# EAGLE design Shield_bmp280_Lora (EAGLE 9.6.1)
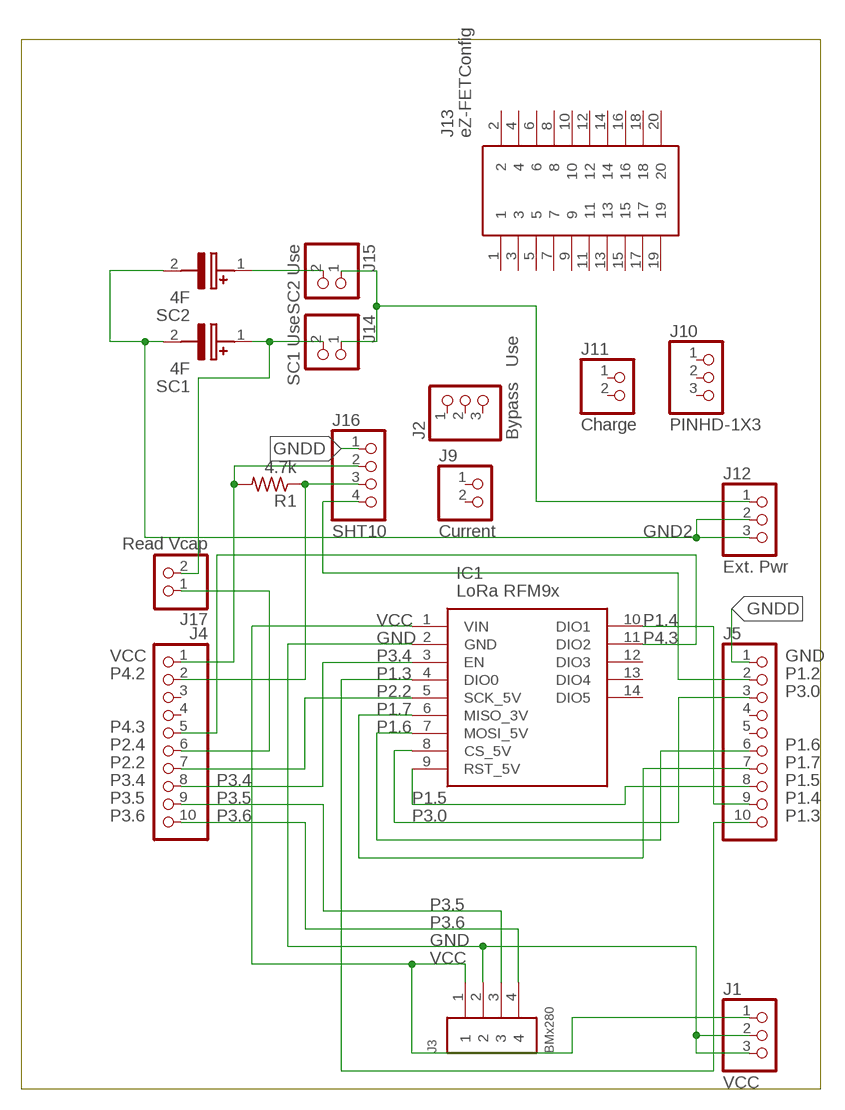
[diagram p0: schematic, sheet 1]

## Parts
IC1  LoRa RFM9x  3072  [3072]
J1  VCC  PINHD-1X3  [1X03]
J2  Bypass Use  PINHD-1X3  [1X03]
J3  BMx280  61300411121  [61300411121]
J4  VCC  PINHD-1X10  [1X10-BIG]
J5  GND  PINHD-1X10  [1X10-BIG]
J9  Current  PINHD-1X2  [1X02]
J10  PINHD-1X3  [1X03]
J11  Charge  PINHD-1X2  [1X02]
J12  Ext. Pwr  PINHD-1X3  [1X03]
J13  eZ-FETConfig  HWS1881  [HWS1881]
J14  SC1 Use  PINHD-1X2  [1X02]
J15  SC2 Use  PINHD-1X2  [1X02]
J16  SHT10  PINHD-1X4  [1X04]
J17  Read Vcap  PINHD-1X2  [1X02]
R1  4.7k  R-US_0204/7  [0204/7]
SC1  4F  EEC-RG0V105VN  [EECRG0V105VN]
SC2  4F  EEC-RG0V105VN  [EECRG0V105VN]

## Nets
GND: IC1.2(GND) J1.2 J1.3 J3.2
GND2: J12.2 J12.3 SC1.2(-) SC2.2(-)
GNDD: J5.1 J16.1
N$2: J14.2 J17.2 SC1.1(+)
N$3: J15.2 SC2.1(+)
P1.2: J5.2 J16.4
P1.3: IC1.4(DIO0) J5.10
P1.4: IC1.10(DIO1) J5.9
P1.5: IC1.9(RST_5V) J5.8
P1.6: IC1.7(MOSI_5V) J5.6
P1.7: IC1.6(MISO_3V) J5.7
P2.2: IC1.5(SCK_5V) J4.7
P2.4: J4.6 J17.1
P3.0: IC1.8(CS_5V) J5.3
P3.4: IC1.3(EN) J4.8
P3.5: J3.3 J4.9
P3.6: J3.4 J4.10
P4.2: J4.2 J16.3 R1.1
P4.3: IC1.11(DIO2) J4.5
VCC: IC1.1(VIN) J1.1 J3.1
VCCA: J4.1 J16.2 R1.2
VCCC: J12.1 J14.1 J15.1
Unconnected: IC1.12(DIO3) IC1.13(DIO4) IC1.14(DIO5) J2.1 J2.2 J2.3 J4.3 J4.4 J5.4 J5.5 J9.1 J9.2 J10.1 J10.2 J10.3 J11.1 J11.2 J13.1 J13.2 J13.3 J13.4 J13.5 J13.6 J13.7 J13.8 J13.9 J13.10 J13.11 J13.12 J13.13 J13.14 J13.15 J13.16 J13.17 J13.18 J13.19 J13.20

## Library data of the parts
IC1 = 3072:3072: RF Development Tools Adafruit RFM95W LoRa Radio Transceiver Breakout - 868 or 915 MHz - RadioFruit Source: Datasheet <https://cdn-learn.adafruit.com/downloads/pdf/adafruit-rfm69hcw-and-rfm96-rfm95-rfm98-lora-packet-padio-breakouts.pdf?timestamp=1543558897>; ALLIED_NUMBER: 70928126; ALLIED_PRICE-STOCK: https://www.alliedelec.com/adafruit-industries-3072/70928126/; DESCRIPTION: RF Development Tools Adafruit RFM95W LoRa Radio Transceiver Breakout - 868 or 915 MHz - RadioFruit; HEIGHT: 4mm; MANUFACTURER_NAME: Adafruit; MANUFACTURER_PART_NUMBER: 3072; MOUSER_PART_NUMBER: 485-3072; MOUSER_PRICE-STOCK: https://www.mouser.co.uk/ProductDetail/Adafruit/3072?qs=AGnqjqvSJvLNoNWdrCTgvw%3D%3D
J1 J2 J10 J12 = Connector:PINHD-1X3: PIN HEADER; CATEGORY: CONNECTOR; SUB-CATEGORY: PIN-HEADER
J3 = Headers:61300411121: CONN HEADER VERT 4POS 2.54MM Manufacturer's datasheet <https://katalog.we-online.de/em/datasheet/6130xx11121.pdf>; CREATED_BY: PCBLayout.com; DIGI_KEY_PART_NUMBER: 732-5317-ND; MANUFACTURER: Wurth Electronics Inc.; MPN: 61300411121
J4 J5 = adafruit:PINHD-1X10: Pin header 1x10 0.1" spacing With round pins
J9 J11 J14 J15 J17 = Connector:PINHD-1X2: PIN HEADER; CATEGORY: CONNECTOR; SUB-CATEGORY: PIN-HEADER
J13 = HWS1881:HWS1881: FEMALE HEADER SOCKET 20 PIN 2X10 FEMALE RECEPTACLE RIGHT ANGLE .1"(2.54mm) CENTERLINE (.1" Pin Spacing .1" Row Spacing) DUAL ROW MATES WITH .025" SQUARE POST HEADERS GOLD PLATED CONTACTS PCB MOUNT SOLDER TAILS Source: Datasheet <https://www.peconnectors.com/female-headers-pcb-2x-row-.100/hws16307/?gclid=EAIaIQobChMI66Wj_9bL5AIVAtlkCh3PUwyBEAQYAiABEgKUsvD_BwE>; DESCRIPTION: FEMALE HEADER SOCKET 20 PIN 2X10 FEMALE RECEPTACLE RIGHT ANGLE .1"(2.54mm) CENTERLINE (.1" Pin Spacing .1" Row Spacing) DUAL ROW MATES WITH .025" SQUARE POST HEADERS GOLD PLATED CONTACTS PCB MOUNT SOLDER TAILS; HEIGHT: 8.5mm; MANUFACTURER_NAME: PE Connectors; MANUFACTURER_PART_NUMBER: HWS1881
J16 = Connector:PINHD-1X4: PIN HEADER; CATEGORY: CONNECTOR; SUB-CATEGORY: PIN-HEADER
R1 = adafruit:R-US_: RESISTOR, American symbol
SC1 SC2 = EEC-RG0V105VN:EEC-RG0V105VN: Supercapacitors / Ultracapacitors FACTORY NOT ACCEPTING ORDERS Source: Datasheet <https://industrial.panasonic.com/cdbs/www-data/pdf/RDG0000/ABC0000C81.pdf>; DESCRIPTION: Supercapacitors / Ultracapacitors FACTORY NOT ACCEPTING ORDERS; HEIGHT: 21mm; MANUFACTURER_NAME: Panasonic; MANUFACTURER_PART_NUMBER: EEC-RG0V105VN; MOUSER_PART_NUMBER: 667-EEC-RG0V105VN; MOUSER_PRICE-STOCK: https://www.mouser.com/Search/Refine.aspx?Keyword=667-EEC-RG0V105VN

## Board
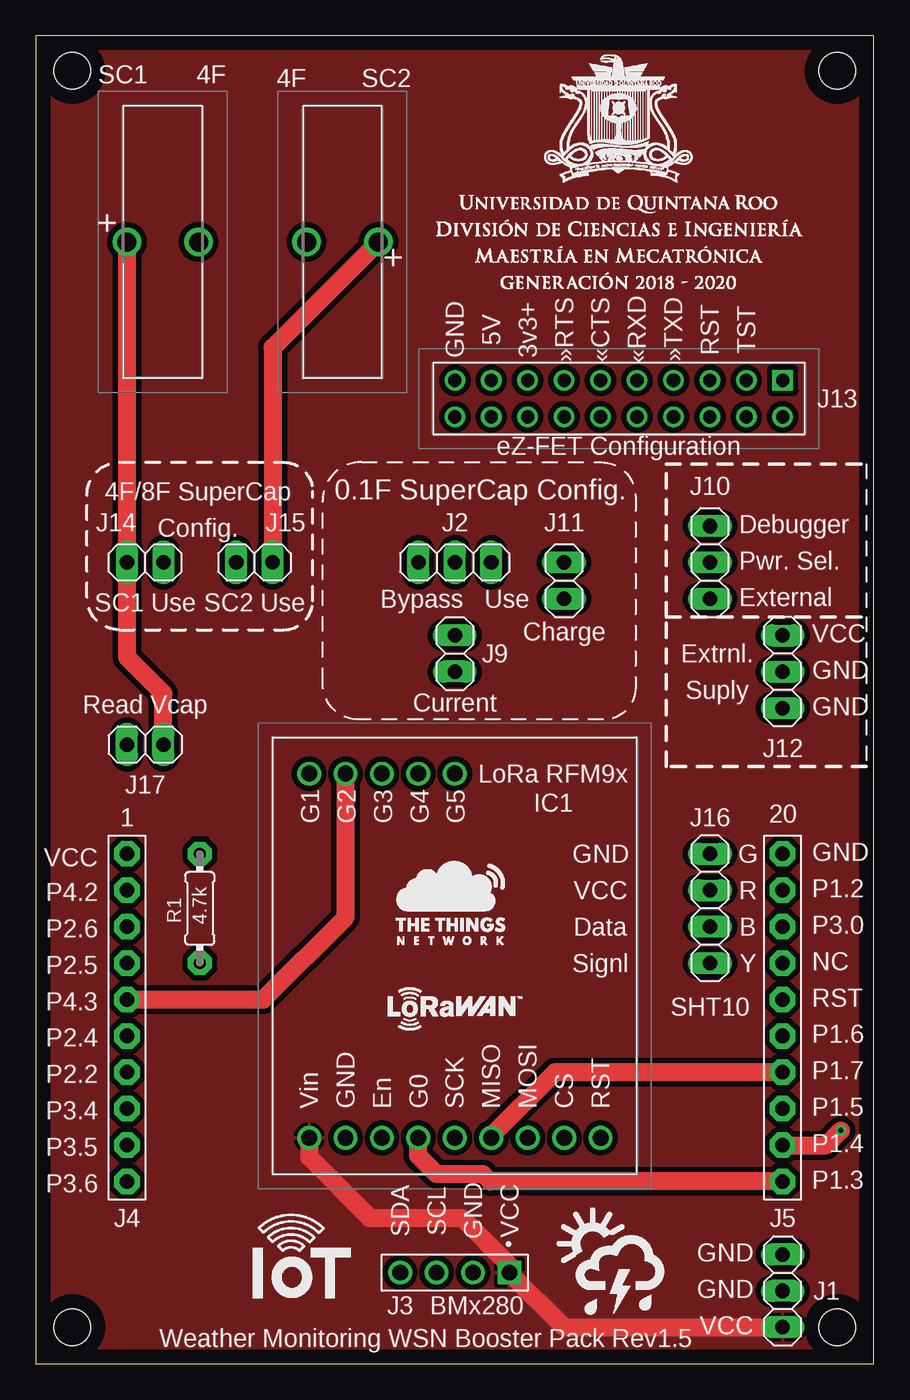
[diagram p1: board, top side]
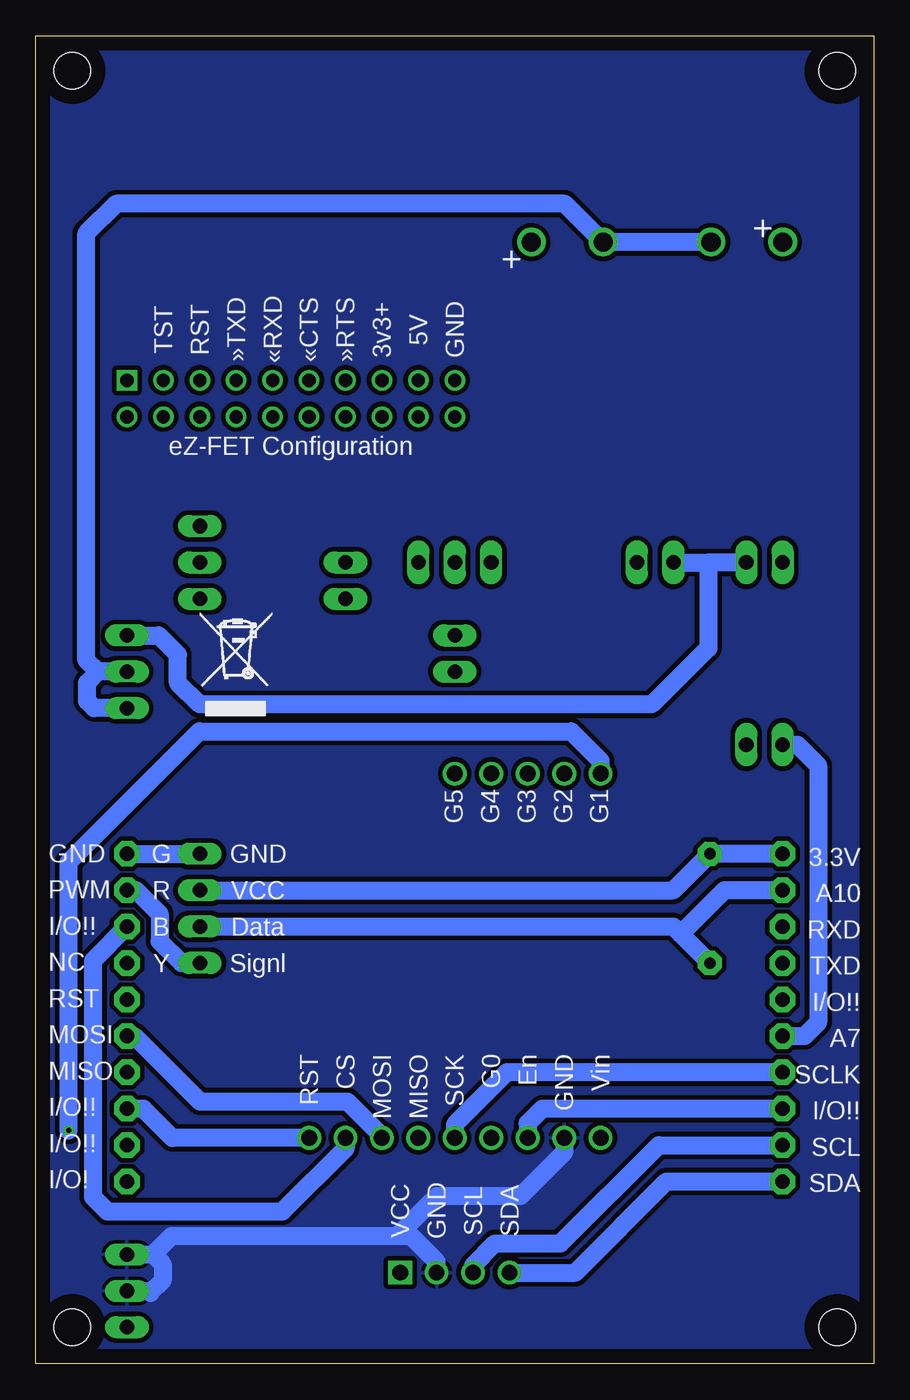
[diagram p2: board, bottom side, seen from below]

Size 58.42 x 92.61 mm. Coordinates in mm from the lower left corner, seen from the top.
Outline: 0,0 58.42,0 58.42,92.61 0,92.61 0,0
Copper layers (1*16): Top 0.035mm / dielectric 1.5mm / Bottom 0.035mm
Design rules "default": minimum track width 6mil, minimum drill 0.35mm, track to track 6mil, track to pad 6mil, pad to pad 6mil, via to via 6mil, smd to smd 6mil, copper to edge 40mil, drill to drill 6mil, minimum pad ring 10mil, minimum via ring 8mil, stop-mask expansion 4mil, vias tented up to drill 0mil, thermal gap 10mil
Holes 2.54 mm at 2.54,2.54 55.88,2.54 55.88,90.17 2.54,90.17

### Footprints (pad centres in the part's own frame; a part is rotated, then mirrored left to right if it is on the bottom)
3072 = drill 1.11 pad 1.665: 1 0,0; 2 2.54,0; 3 5.08,0; 4 7.62,0; 5 10.16,0; 6 12.7,0; 7 15.24,0; 8 17.78,0; 9 20.32,0; 10 0,25.4; 11 2.54,25.4; 12 5.08,25.4; 13 7.62,25.4; 14 10.16,25.4
1X03 = drill 1.016 long: 1 -2.54,0; 2 0,0; 3 2.54,0
61300411121 = drill 1.1 square: 1 -3.81,0 | drill 1.1: 2 -1.27,0; 3 1.27,0; 4 3.81,0
1X10-BIG = drill 1.016 pad 1.778 octagon: 1 -11.43,0; 2 -8.89,0; 3 -6.35,0; 4 -3.81,0; 5 -1.27,0; 6 1.27,0; 7 3.81,0; 8 6.35,0; 9 8.89,0; 10 11.43,0
1X02 = drill 1.016 long: 1 -1.27,0; 2 1.27,0
HWS1881 = drill 0.92 pad 1.431 square: 1 0,0 | drill 0.92 pad 1.431: 2 0,2.54; 3 2.54,0; 4 2.54,2.54; 5 5.08,0; 6 5.08,2.54; 7 7.62,0; 8 7.62,2.54; 9 10.16,0; 10 10.16,2.54; 11 12.7,0; 12 12.7,2.54; 13 15.24,0; 14 15.24,2.54; 15 17.78,0; 16 17.78,2.54; 17 20.32,0; 18 20.32,2.54; 19 22.86,0; 20 22.86,2.54
1X04 = drill 1.016 long: 1 -3.81,0; 2 -1.27,0; 3 1.27,0; 4 3.81,0
0204/7 = drill 0.813 pad 1.676 octagon: 1 -3.81,0; 2 3.81,0
EECRG0V105VN = drill 1.33 pad 1.995: 1 0,0; 2 5,0

### Placement (x,y rotation side)
IC1  19.05,15.75 0 top
J1  52.07,5.08 90 top
J2  29.21,55.88 0 top
J3  29.21,6.35 180 top
J4  6.35,24.13 270 top
J5  52.07,24.13 270 top
J9  29.21,49.53 90 top
J10  46.99,55.88 90 top
J11  36.83,54.61 90 top
J12  52.07,48.26 270 top
J13  52.07,68.58 180 top
J14  7.62,55.88 180 top
J15  15.24,55.88 0 top
J16  46.99,31.75 270 top
J17  7.62,43.18 0 top
R1  11.43,31.75 90 top
SC1  6.35,78.23 0 top
SC2  23.88,78.23 180 top

### Tracks (layer width: path | path; a pad name or v marks a point on that pad's centre or on a via)
GND
  Bottom 1.27: J1.2 50.6,5.08 50.44,4.93 49.58,5.79 49.58,6.96 50.24,7.62 | J1.3 50.24,7.62 | IC1.2 21.59,14.73 24.64,11.68 30.48,11.68 33.27,8.89 | 50.24,7.62 48.97,8.89 33.27,8.89 | J3.2 30.48,7.11 32.26,8.89 33.27,8.89
  pour Bottom (isolate 0.33): 0.13,0.64 0.13,0.38 0.38,0.13 0.89,0.13 58.04,0.13 58.29,0.38 58.29,1.91 58.29,92.2 58.04,92.46 56.77,92.46 0.38,92.46 0.13,92.2 0.13,40.26
GND2
  Bottom 1.27: J12.3 54.36,45.72 54.85,46.22 54.85,47.48 54.08,48.26 J12.2 54.1,48.26 54.89,49.05 54.89,78.84 52.83,80.9 21.54,80.9 SC2.2 SC1.2
GNDD
  Bottom 1.27: J5.1 J16.1
N$2
  Top 1.27: J17.2 8.89,46.74 6.35,49.28 J14.2 SC1.1
N$3
  Top 1.27: SC2.1 16.51,70.87 J15.2
P1.2
  Bottom 1.27: J5.2 51.44,33.02 49.78,31.37 49.78,29.46 48.26,27.94 J16.4
P1.3
  Top 1.27: J5.10 31.67,12.7 31.17,13.21 27.94,13.21 26.64,14.5 26.64,15.72 IC1.4
P1.4  (via drill 0.35)
  Top 1.27: J5.9 55.12,15.24 v56.13,16.26
  Bottom 1.27: IC1.10 19.05,42.04 21.11,44.09 47.03,44.09 56.13,34.99 v56.13,16.26
P1.5
  Bottom 1.27: J5.8 50.93,17.78 48.9,15.75 IC1.9
P1.6
  Bottom 1.27: J5.6 51.56,22.86 46.99,18.29 36.7,18.29 34.29,15.88 IC1.7
P1.7
  Top 0.152: 31.75,15.88 IC1.6
  Top 1.27: 31.75,15.88 36.2,20.32 J5.7
P2.2
  Bottom 1.27: J4.7 25.58,20.32 29.21,16.69 IC1.5
P2.4
  Bottom 1.27: J4.6 4.83,22.86 3.89,23.8 3.89,41.73 5.33,43.18 J17.1
P3.0
  Bottom 1.27: IC1.8 36.83,15.01 41.22,10.62 53.44,10.62 54.43,11.61 54.43,28.12 J5.3
P3.4
  Bottom 1.27: J4.8 23.11,17.78 24.13,16.76 IC1.3
P3.5
  Bottom 1.27: J4.9 14.99,15.24 21.84,8.38 26.42,8.38 27.94,6.86 J3.3
P3.6
  Bottom 1.27: J4.10 14.45,12.7 20.8,6.35 J3.4
P4.2
  Bottom 1.27: J16.3 13.97,30.48 13.46,29.97 | 13.46,29.97 R1.1 | 13.46,29.97 10.41,33.02 J4.2
P4.3
  Top 1.27: J4.5 15.86,25.4 21.59,31.13 IC1.11
VCC
  Top 1.27: 19.05,14.44 23.27,10.16 29.72,10.16 33.02,6.86 J3.1 36.83,2.54 J1.1 | IC1.1 19.05,14.44 | 19.05,14.44 19.05,14.4
  pour Top (isolate 0.381): 0.13,0.13 0.13,92.2 0.38,92.46 2.29,92.46 58.04,92.46 58.29,92.2 58.29,89.66 58.29,86.87 58.29,0.38 58.04,0.13
VCCA
  Bottom 1.27: J4.1 R1.2 13.97,33.02 J16.2
VCCC
  Bottom 1.27: J12.1 49.86,50.8 48.51,49.45 48.51,47.47 46.98,45.97 15.49,45.97 11.53,49.91 11.53,55.88 | J15.1 11.53,55.88 | J14.1 11.53,55.88

### Text on the board
tPlace: + | +
bPlace: + | +
tNames: GND / 5V / 3v3+ / »RTS / «CTS / «RXD / »TXD / RST / TST | eZ-FET Configuration | 0.1F SuperCap Config. | 4F/8F SuperCap / Config. | Debugger / Pwr. Sel. / External | Extrnl. / Suply | VCC / GND / GND | G1 / G2 / G3 / G4 / G5 | 1 | 20 | P4.2 / P2.6 / P2.5 / P4.3 / P2.4 / P2.2 / P3.4 / P3.5 / P3.6 | GND / VCC / Data / Signl | G / R / B / Y | Vin / GND / En / G0 / SCK / MISO / MOSI / CS / RST | P1.2 / P3.0 / NC / RST / P1.6 / P1.7 / P1.5 / P1.4 / P1.3 | SDA / SCL / GND / VCC | GND | GND | Weather Monitoring WSN Booster Pack Rev1.5
bNames: TST / RST / »TXD / «RXD / «CTS / »RTS / 3v3+ / 5V / GND | eZ-FET Configuration | G5 / G4 / G3 / G2 / G1 | 3.3V / A10 / RXD / TXD / I/O!! / A7 / SCLK / I/O!! / SCL / SDA | GND / PWM / I/O!! / NC / RST / MOSI / MISO / I/O!! / I/O!! / I/O! | GND / VCC / Data / Signl | G / R / B / Y | RST / CS / MOSI / MISO / SCK / G0 / En / GND / Vin | VCC / GND / SCL / SDA